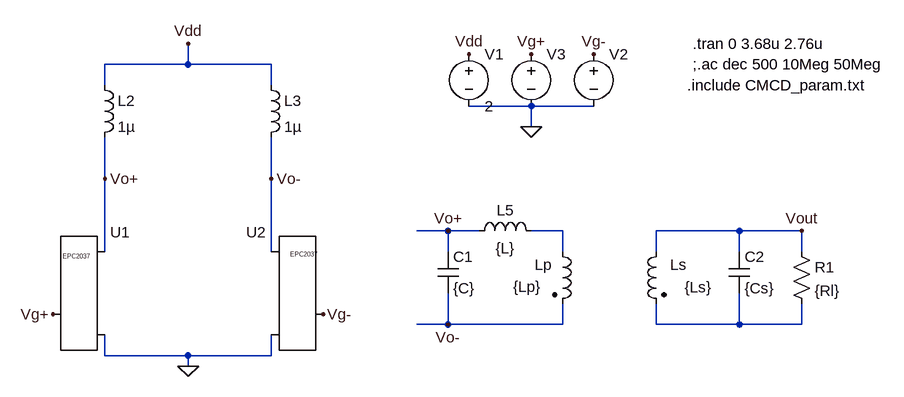
[diagram p0: schematic CMCD_Coil.asc]
CMCD_Coil.asc, the LTspice schematic file:
Version 4
SHEET 1 1080 680
WIRE -96 -64 -96 -96
WIRE -96 -64 -224 -64
WIRE 32 -64 -96 -64
WIRE -224 -32 -224 -64
WIRE 32 -32 32 -64
WIRE 432 0 336 0
WIRE 528 0 432 0
WIRE 432 32 432 0
WIRE -224 112 -224 48
WIRE 32 112 32 48
WIRE 304 192 256 192
WIRE 352 192 304 192
WIRE 480 192 432 192
WIRE 752 192 624 192
WIRE 848 192 752 192
WIRE -224 224 -224 112
WIRE 32 224 32 112
WIRE 304 224 304 192
WIRE 480 224 480 192
WIRE 624 224 624 192
WIRE 752 224 752 192
WIRE 848 224 848 192
WIRE 304 336 304 288
WIRE 304 336 256 336
WIRE 480 336 480 304
WIRE 480 336 304 336
WIRE 624 336 624 304
WIRE 752 336 752 288
WIRE 752 336 624 336
WIRE 848 336 848 304
WIRE 848 336 752 336
WIRE -224 384 -224 352
WIRE -96 384 -224 384
WIRE 32 384 32 352
WIRE 32 384 -96 384
WIRE -96 400 -96 384
FLAG -96 400 0
FLAG -96 -96 Vdd
FLAG -304 320 Vg+
FLAG 112 320 Vg-
FLAG 432 32 0
FLAG 336 -80 Vdd
FLAG 432 -80 Vg+
FLAG 528 -80 Vg-
FLAG -224 112 Vo+
FLAG 32 112 Vo-
FLAG 304 192 Vo+
FLAG 304 336 Vo-
FLAG 848 192 Vout
SYMBOL EPCGaN -304 320 R0
WINDOW 3 15 -89 Left 0
SYMATTR Value EPC2037
SYMATTR InstName U1
SYMBOL EPCGaN 112 320 M0
WINDOW 3 8 -92 Left 0
SYMATTR Value EPC2037
SYMATTR InstName U2
SYMBOL ind -240 -48 R0
SYMATTR InstName L2
SYMATTR Value 1µ
SYMBOL ind 16 -48 R0
SYMATTR InstName L3
SYMATTR Value 1µ
SYMBOL voltage 336 -96 R0
WINDOW 123 0 0 Left 0
WINDOW 39 0 0 Left 0
SYMATTR InstName V1
SYMATTR Value 2
SYMBOL voltage 528 -96 R0
WINDOW 3 24 96 Invisible 2
SYMATTR Value PULSE(0 5 18.4365n 0.1n 0.1n 15n 36.873n)
SYMATTR Value2 AC 1
SYMATTR SpiceLine Rser=20
SYMATTR InstName V2
SYMBOL voltage 432 -96 R0
WINDOW 3 24 96 Invisible 2
SYMATTR Value PULSE(0 5 0 0.1n 0.1n 15n 36.873n)
SYMATTR Value2 AC 1
SYMATTR SpiceLine Rser=20
SYMATTR InstName V3
SYMBOL cap 288 224 R0
SYMATTR InstName C1
SYMATTR Value {C}
SYMBOL ind2 464 208 R0
WINDOW 0 -27 36 Left 2
WINDOW 3 -60 70 Left 2
SYMATTR InstName Lp
SYMATTR Value {Lp}
SYMATTR Type ind
SYMATTR SpiceLine Rser={Rp} Cpar={Cpp}
SYMBOL ind2 640 208 M0
WINDOW 0 -31 36 Left 2
WINDOW 3 -70 71 Left 2
SYMATTR InstName Ls
SYMATTR Value {Ls}
SYMATTR Type ind
SYMATTR SpiceLine Rser={Rs} Cpar={Cps}
SYMBOL cap 736 224 R0
SYMATTR InstName C2
SYMATTR Value {Cs}
SYMBOL res 832 208 R0
SYMATTR InstName R1
SYMATTR Value {Rl}
SYMBOL ind 336 208 R270
WINDOW 0 32 56 VTop 2
WINDOW 3 5 56 VBottom 2
SYMATTR InstName L5
SYMATTR Value {L}
TEXT 672 -32 Left 2 !.include CMCD_param.txt
TEXT 680 -96 Left 2 !.tran 0 3.68u 2.76u
TEXT 680 -64 Left 2 !;.ac dec 500 10Meg 50Meg

The netlist it stands for:
* CMCD_Coil.asc
XU1 Vg+ Vo+ 0 EPC2037
XU2 Vg- Vo- 0 EPC2037
L2 Vdd Vo+ 1µ
L3 Vdd Vo- 1µ
V1 Vdd 0 2
V2 Vg- 0 PULSE(0 5 18.4365n 0.1n 0.1n 15n 36.873n) AC 1 Rser=20
V3 Vg+ 0 PULSE(0 5 0 0.1n 0.1n 15n 36.873n) AC 1 Rser=20
C1 Vo+ Vo- {C}
Lp N001 Vo- {Lp} Rser={Rp} Cpar={Cpp}
Ls Vout N002 {Ls} Rser={Rs} Cpar={Cps}
C2 Vout N002 {Cs}
R1 Vout N002 {Rl}
L5 Vo+ N001 {L}
.include CMCD_param.txt
.tran 0 3.68u 2.76u
;.ac dec 500 10Meg 50Meg
.backanno
.end